# Altium schematic sheet module_rev1.SchDoc
size A
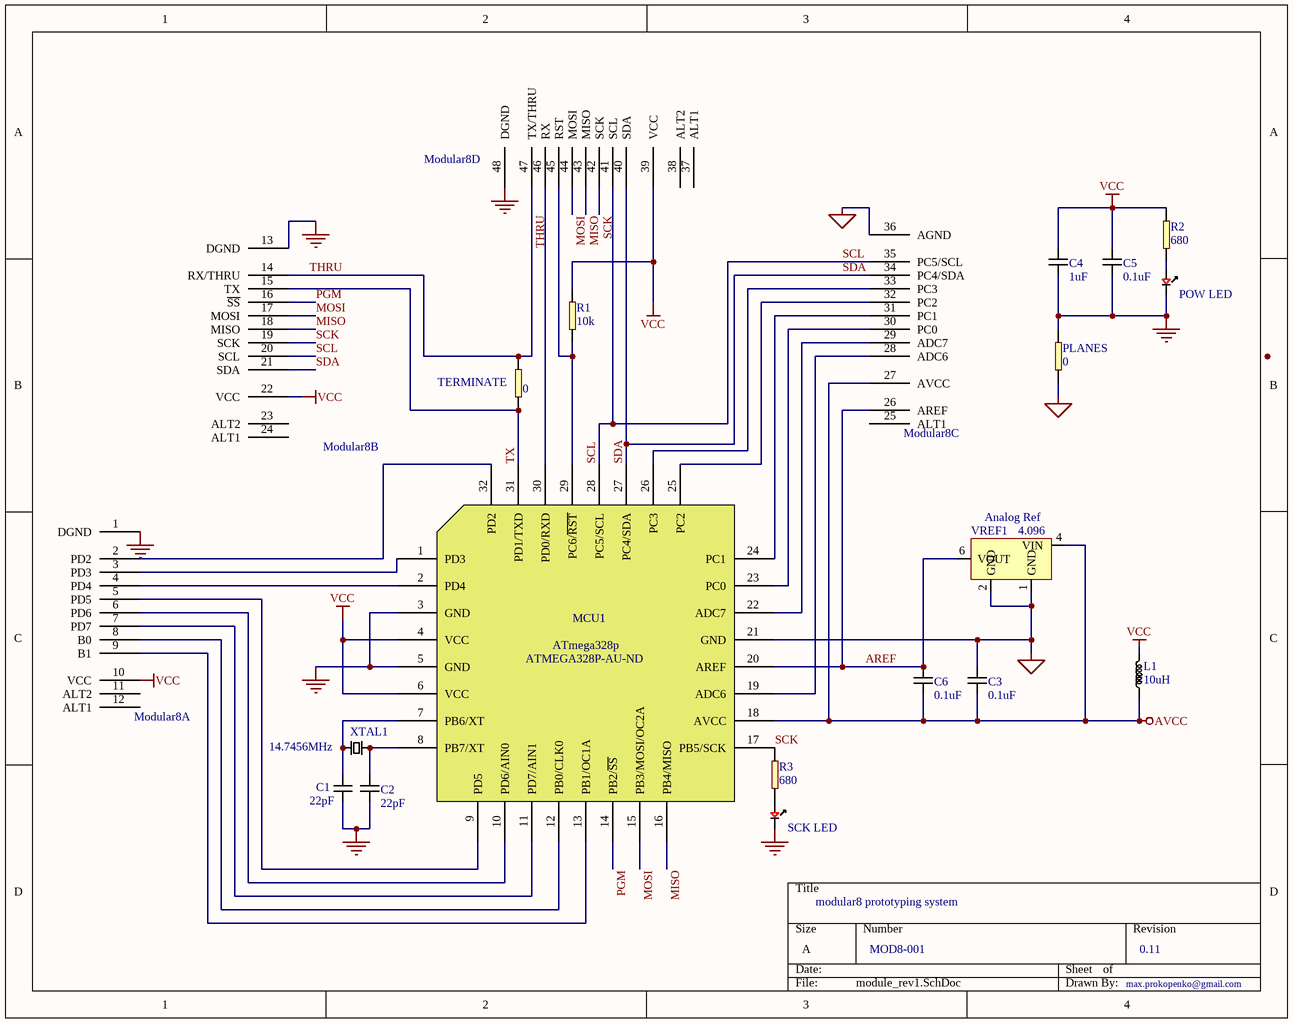
[diagram p0: module_rev1.SchDoc]

## Parts
C1  C: 22pF  [0603]  (hidden comment: C 22pF 50V)
C2  C: 22pF  [0603]  (hidden comment: C 22pF 50V)
C3  C: 0.1uF  [0603]  (hidden comment: C 0.1uF 25V)
C4  C: 1uF  [0603]  (hidden comment: C 1uF 25V)
C5  C: 0.1uF  [0603]  (hidden comment: C 0.1uF 25V)
C6  C: 0.1uF  [0603]  (hidden comment: C 0.1uF 25V)
L1  L: 10uH  [0603]  (hidden comment: L 10uH)
MCU1  ATmega328p  Supplier Part Number 1: ATMEGA328P-AU-ND  [ATmega328p TQFP]
Modular8  Modular8  [modular8]  (value not drawn)  (parts A,B,C,D of 4)
PLANES  R: 0  [0603]  (hidden comment: R 0)
POW_LED  LEDR  [0603]  (value not drawn)
R1  R: 10k  [0603]  (hidden comment: R 10k)
R2  R: 680  [0603]  (hidden comment: R 680)
R3  R: 680  [0603]  (hidden comment: R 680)
SCK_LED  LEDR  [0603]  (value not drawn)
TERMINATE  R: 0  [0603]  (hidden comment: R 0)
VREF1  Analog Ref  VREF: 4.096  [TSOT-23-6]
XTAL1  Frequency: 14.7456MHz  [XTAL CSM-3X]  (hidden comment: XTAL 14.7456MHz)

## Nets
AGND: C3.1 MCU1.21(GND) Modular8.36(AGND) PLANES.1 VREF1.1(GND) VREF1.2(GND)
AVCC: C3.2 C6.2 L1.2 MCU1.18(AVCC) Modular8.27(AVCC) VREF1.4(VIN)
DGND: C1.1 C2.2 C4.2 C5.2 MCU1.3(GND) MCU1.5(GND) Modular8.1(DGND) Modular8.13(DGND) Modular8.48(DGND) PLANES.2 POW_LED.1(K) SCK_LED.1(K)
VCC: C4.1 C5.1 L1.1 MCU1.4(VCC) MCU1.6(VCC) Modular8.10(VCC) Modular8.22(VCC) Modular8.39(VCC) R1.1 R2.1
AREF: C6.1 MCU1.20(AREF) Modular8.26(AREF) VREF1.6(VOUT)
MISO: MCU1.16(PB4/MISO) Modular8.18(MISO) Modular8.43(MISO)
MOSI: MCU1.15(PB3/MOSI/OC2A) Modular8.17(MOSI) Modular8.44(MOSI)
PGM: MCU1.14(PB2/~{SS}) Modular8.16(~{SS})
SCK: MCU1.17(PB5/SCK) Modular8.19(SCK) Modular8.42(SCK) R3.1
SCL: MCU1.28(PC5/SCL) Modular8.20(SCL) Modular8.35(PC5/SCL) Modular8.41(SCL)
SDA: MCU1.27(PC4/SDA) Modular8.21(SDA) Modular8.34(PC4/SDA) Modular8.40(SDA)
THRU: Modular8.14(RX/THRU) Modular8.47(TX/THRU) TERMINATE.1
TX: MCU1.31(PD1/TXD) Modular8.15(TX) TERMINATE.2
NetC1_2: C1.2 MCU1.7(PB6/XT) XTAL1.1
NetC2_1: C2.1 MCU1.8(PB7/XT) XTAL1.2
NetMCU1_1: MCU1.1(PD3) Modular8.3(PD3)
NetMCU1_2: MCU1.2(PD4) Modular8.4(PD4)
NetMCU1_9: MCU1.9(PD5) Modular8.5(PD5)
NetMCU1_10: MCU1.10(PD6/AIN0) Modular8.6(PD6)
NetMCU1_11: MCU1.11(PD7/AIN1) Modular8.7(PD7)
NetMCU1_12: MCU1.12(PB0/CLK0) Modular8.8(B0)
NetMCU1_13: MCU1.13(PB1/OC1A) Modular8.9(B1)
NetMCU1_19: MCU1.19(ADC6) Modular8.28(ADC6)
NetMCU1_22: MCU1.22(ADC7) Modular8.29(ADC7)
NetMCU1_23: MCU1.23(PC0) Modular8.30(PC0)
NetMCU1_24: MCU1.24(PC1) Modular8.31(PC1)
NetMCU1_25: MCU1.25(PC2) Modular8.32(PC2)
NetMCU1_26: MCU1.26(PC3) Modular8.33(PC3)
NetMCU1_29: MCU1.29(PC6/~{RST}) Modular8.45(RST) R1.2
NetMCU1_30: MCU1.30(PD0/RXD) Modular8.46(RX)
NetMCU1_32: MCU1.32(PD2) Modular8.2(PD2)
NetPOW_LED_2: POW_LED.2(A) R2.2
NetR3_2: R3.2 SCK_LED.2(A)

Not connected (* = marked no-connect by the designer): Modular8 11(ALT2) 12(ALT1) 23(ALT2) 24(ALT1) 25(ALT1) 37(ALT1) 38(ALT2)

## Notes on the sheet
- modular8 prototyping system
- MOD8-001
- 0.11
- max.prokopenko@gmail.com

## Library data of the parts
VREF1 = LT1790BCS6: Supplier 1: Digi-Key; Supplier Part Number 1: LT1790BCS6-4.096#TRMPBFCT-ND
C1 C2 = C 22pF 50V: Supplier 1: Digi-Key; Supplier Part Number 1: 445-1273-1-ND
C3 C5 C6 = C 0.1uF 25V: Supplier 1: Digi-Key; Supplier Part Number 1: 445-1316-1-ND
C4 = C 1uF 25V: Supplier 1: Digi-Key; Supplier Part Number 1: 1276-1858-1-ND
L1 = L 10uH: Supplier 1: Digi-Key; Supplier Part Number 1: 490-4025-1-ND
MCU1 = ATmega328p: Supplier 1: Digi-Key
PLANES TERMINATE = R 0: Supplier 1: Digi-Key; Supplier Part Number 1: RHM0.0GCT-ND
POW_LED SCK_LED = LEDR: Supplier 1: Digi-Key; Supplier Part Number 1: 475-2512-1-ND
R1 = R 10k: Supplier 1: Digi-Key; Supplier Part Number 1: 311-10KGRCT-ND
R2 R3 = R 680: Supplier 1: Digi-Key; Supplier Part Number 1: 311-680GRCT-ND
XTAL1 = XTAL 14.7456MHz: Supplier 1: Digi-Key; Supplier Part Number 1: XC1775CT-ND